# Altium schematic sheet Main_Board_Teensy.SchDoc
size A; SheetNumber: 1; SheetTotal: 4
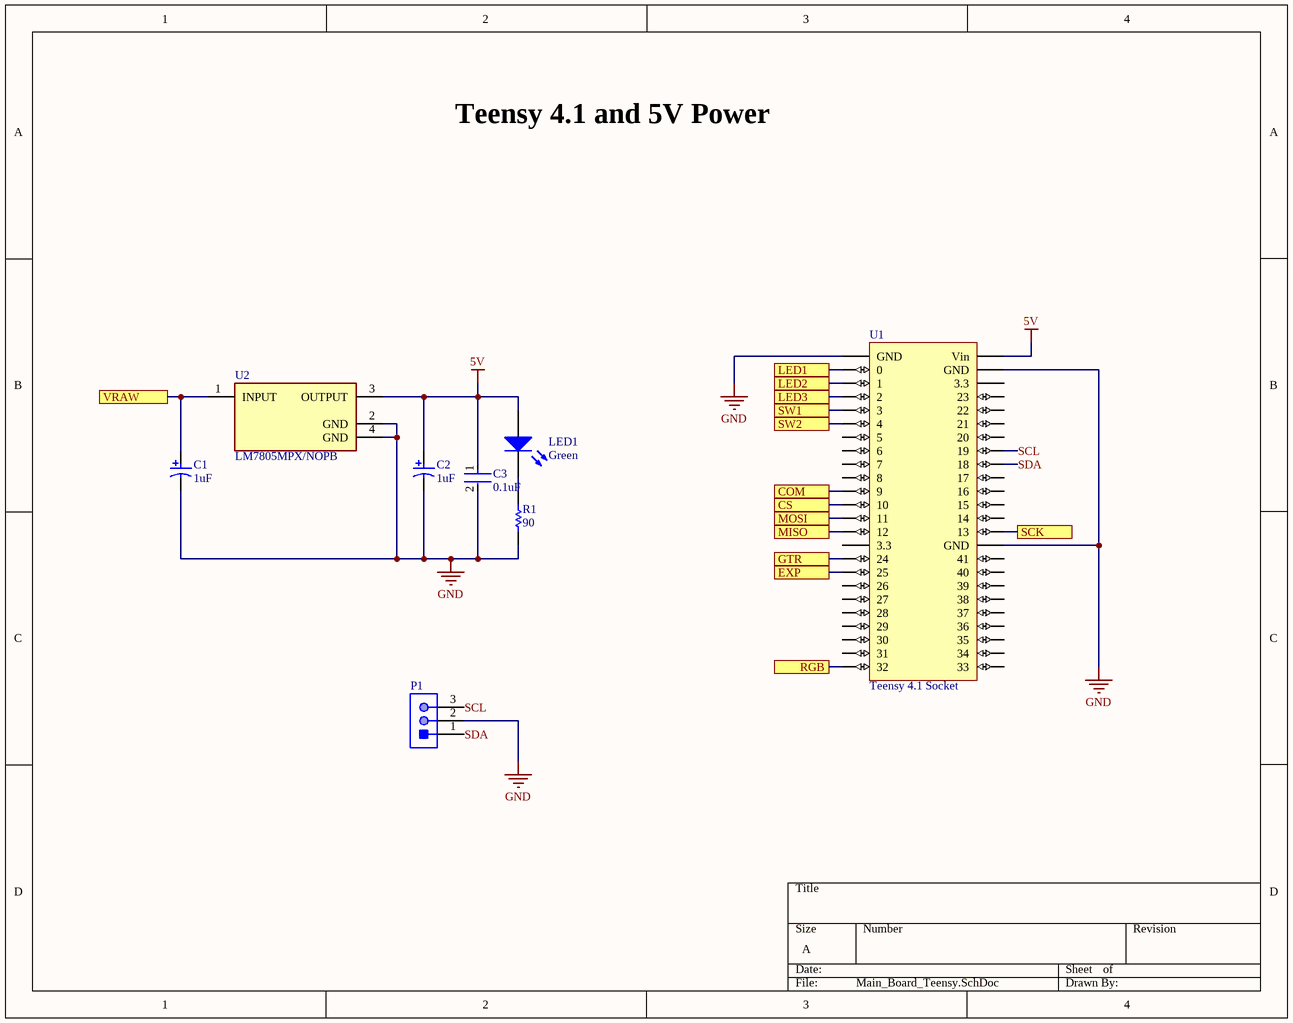
[diagram p0: Main_Board_Teensy.SchDoc]

## Parts
C1  1uF  [KEMT-T491-C_L]
C2  1uF  [KEMT-T491-C_L]
C3  0.1uF  [FP-GCM188-0_1-IPC_B]
LED1  Green  [0603_A]
P1  B3B-PH-K-S(LF)(SN)  [JST-B3B-PH-K-S-3_V]  (value not drawn)
R1  90  [RESC2013X50X40LL20T20]
U1  Teensy 4.1 Socket  [Teensy 4.1 Socket]
U2  LM7805MPX/NOPB  [FP-LM7805MPX-NOPB-MFG]

## Ports
COM, CS, EXP, GTR, LED1, LED2, LED3, MISO, MOSI, RGB, SCK, SW1, SW2, VRAW

## Nets
5V: C2.1 C3.1 LED1.2(A) U1.Vin U2.3(OUTPUT)
GND: C1.2 C2.2 C3.2 P1.2 R1.1 U1.GND1(GND) U1.GND2(GND) U1.GND3(GND) U2.2(GND) U2.4(GND)
COM: U1.9 ; port COM
CS: U1.10 ; port CS
EXP: U1.25 ; port EXP
GTR: U1.24 ; port GTR
LED1: U1.0 ; port LED1
LED2: U1.1 ; port LED2
LED3: U1.2 ; port LED3
MISO: U1.12 ; port MISO
MOSI: U1.11 ; port MOSI
RGB: U1.32 ; port RGB
SCK: U1.13 ; port SCK
SCL: P1.3 U1.19
SDA: P1.1 U1.18
SW1: U1.3 ; port SW1
SW2: U1.4 ; port SW2
VRAW: C1.1 U2.1(INPUT) ; port VRAW
NetLED1_1: LED1.1(K) R1.2

Not connected (* = marked no-connect by the designer): U1 3.3-1(3.3) 3.3-2(3.3) 5 6 7 8 14 15 16 17 20 21 22 23 26 27 28 29 30 31 33 34 35 36 37 38 39 40 41

## Notes on the sheet
- Teensy 4.1 and 5V Power

## Library data of the parts
C1 C2 = CMP-2000-07195-1: Tantalum Capacitor, 1 uF, +/- 10%, 50 V, -55 to 125 degC, 2-Pin SMD, RoHS, Tape and Reel; Manufacturer: Kemet; Capacitance: 1000000pF; Rad Hardened: No; Case Style: Molded; Product Diameter (mm): NotRequiredmm; Seal: NotRequired; DF: 4%; ESR: 5.5ohm; DCL: 0.5uA; Product Length (mm): 6mm; Product Height (mm): 2.5mm; Polarity: Polar; Voltage: 50VDC; Product Depth (mm): 3.2mm; Operating Temp Range: -55Cto125C; Package Description: 2-Pin Surface Mount Device, Body 6 x 3.2 mm; Failure Rate: NotRequired; Seated Plane Height: NotRequiredmm; Lead Spacing (nom): NotRequiredmm; Packaging: TapeandReel; Case Code: C; Length W/Weld: NotRequiredmm; Tolerance (+ or -): 10%; Datasheet URL: http://capacitoredge.kemet.com/capedge2/DataSheet/Datasheet-T491C105K050AT.pdf?pn=T491C105K050AT; Datasheet Version: 10/2016; Manufacturer URL: http://www.kemet.com/; Wire Form: NotRequired; Package / Case: 6032-28; Mounting Technology: SurfaceMount; Construction: SMTChip; Package Reference: T491-C; Length W/Weld (max): NotRequiredmm; Insulation: NotRequired; Mounting Style: SurfaceMount
C3 = CMP-2006-02353-3: Ceramic Capacitor for Automotive 100nF  ±10% 50VDC X8L 0603 Paper T/R; Voltage Rating: 50V; Height: 0.8mm; Lead Free: Lead Free; Case/Package: 0603; Dielectric: X8L; Packaging: Tape and Reel; Termination: SMD/SMT; Package Quantity: 4000; Width: 0.5mm; Max Operating Temperature: 150°C; Case Code (Metric): 1608; Thickness: 0.035inch; Capacitance: 100nF; Tolerance: 10%; Voltage Rating (DC): 50V; Ratings: AEC-Q200; Case Code (Imperial): 0603; Voltage: 50V; Depth: 0.8mm; Radiation Hardening: No; Length: 1.6mm; Mount: Surface Mount; Min Operating Temperature: -55°C
LED1 = CMP-1426-00002-1: SMD mono-color Chip LED, WL-SMCW, Green; PartNumber: 150060GS75000; Manufacturer: Wuerth Elektronik; ComponentLink1URL: http://www.we-online.com; ComponentLink2Description: Datasheet; Color: Green; ComponentLink2URL: http://katalog.we-online.com/led/datasheet/150060GS75000.pdf; PackageReference: 0603_A; ComponentLink1Description: Manufacturer URL
P1 = CMP-2000-05164-1: Male Header, Pitch 2 mm, 1 x 3 Position, Height 6 mm, Tail Length 3.4 mm, -25 to 85 degC, RoHS, Bulk; Manufacturer: JST; Style/Orientation: StraightHeader/Plug; Pitch: 2mm; No of Positions: 3; Termination: Crimp; Manufacturer URL: http://www.jst.com/home2.html; Datasheet Version: Oct-06; Type: ShroudedHeader; Datasheet URL: https://datasheet.ciiva.com/11746/0900766b80826550-11746939.pdf
R1 = CMP-2001-03378-1: Manufacturer: Susumu; Part Number: RR1220P-331-D
U1 = Teensy 4.1 Socket: Teensy 4.1
U2 = CMP-04917-000022-1: IC REG LINEAR 5V 1.5A SOT223-4; Manufacturer: Texas Instruments; Dropout Voltage: 2V; Output Type: Fixed; Accuracy Percentage: 3%; Nominal Supply Current: 8mA; Standoff Height: 0.02mm; Min Supply Voltage: 7.5V; Number Of Outputs: 1; Max Junction Temp: +150°C; Max Supply Voltage: 30V; Height: 1.8mm; Temperature Range High: +125°C; Device Class L3: Voltage Regulators - Linear; Lead Free: Yes; Digikey Description: IC REG LINEAR 5V 1.5A SOT223-4; Output Current: 1.5A; Manufacturer Part Number: LM7805MPX/NOPB; Automotive: No; Device Class L1: Integrated Circuits (ICs); ComponentLink2Description: Datasheet; Device Class L2: Power Management ICs; Category: IC; Octopart: https://octopart.com/lm7805mpx%2Fnopb-texas+instruments-74629992; Package: SOT223-4; RoHS: TRUE; Output Voltage: 5V; Temperature Range Low: 0°C; Temperature: 0°C to +125°C; ComponentLink2URL: http://www.ti.com/lit/ds/symlink/lm7800.pdf